# EAGLE design FY - OPTO_BOARD_4_IOX (EAGLE 6.1)

## Sheet 1 of 2
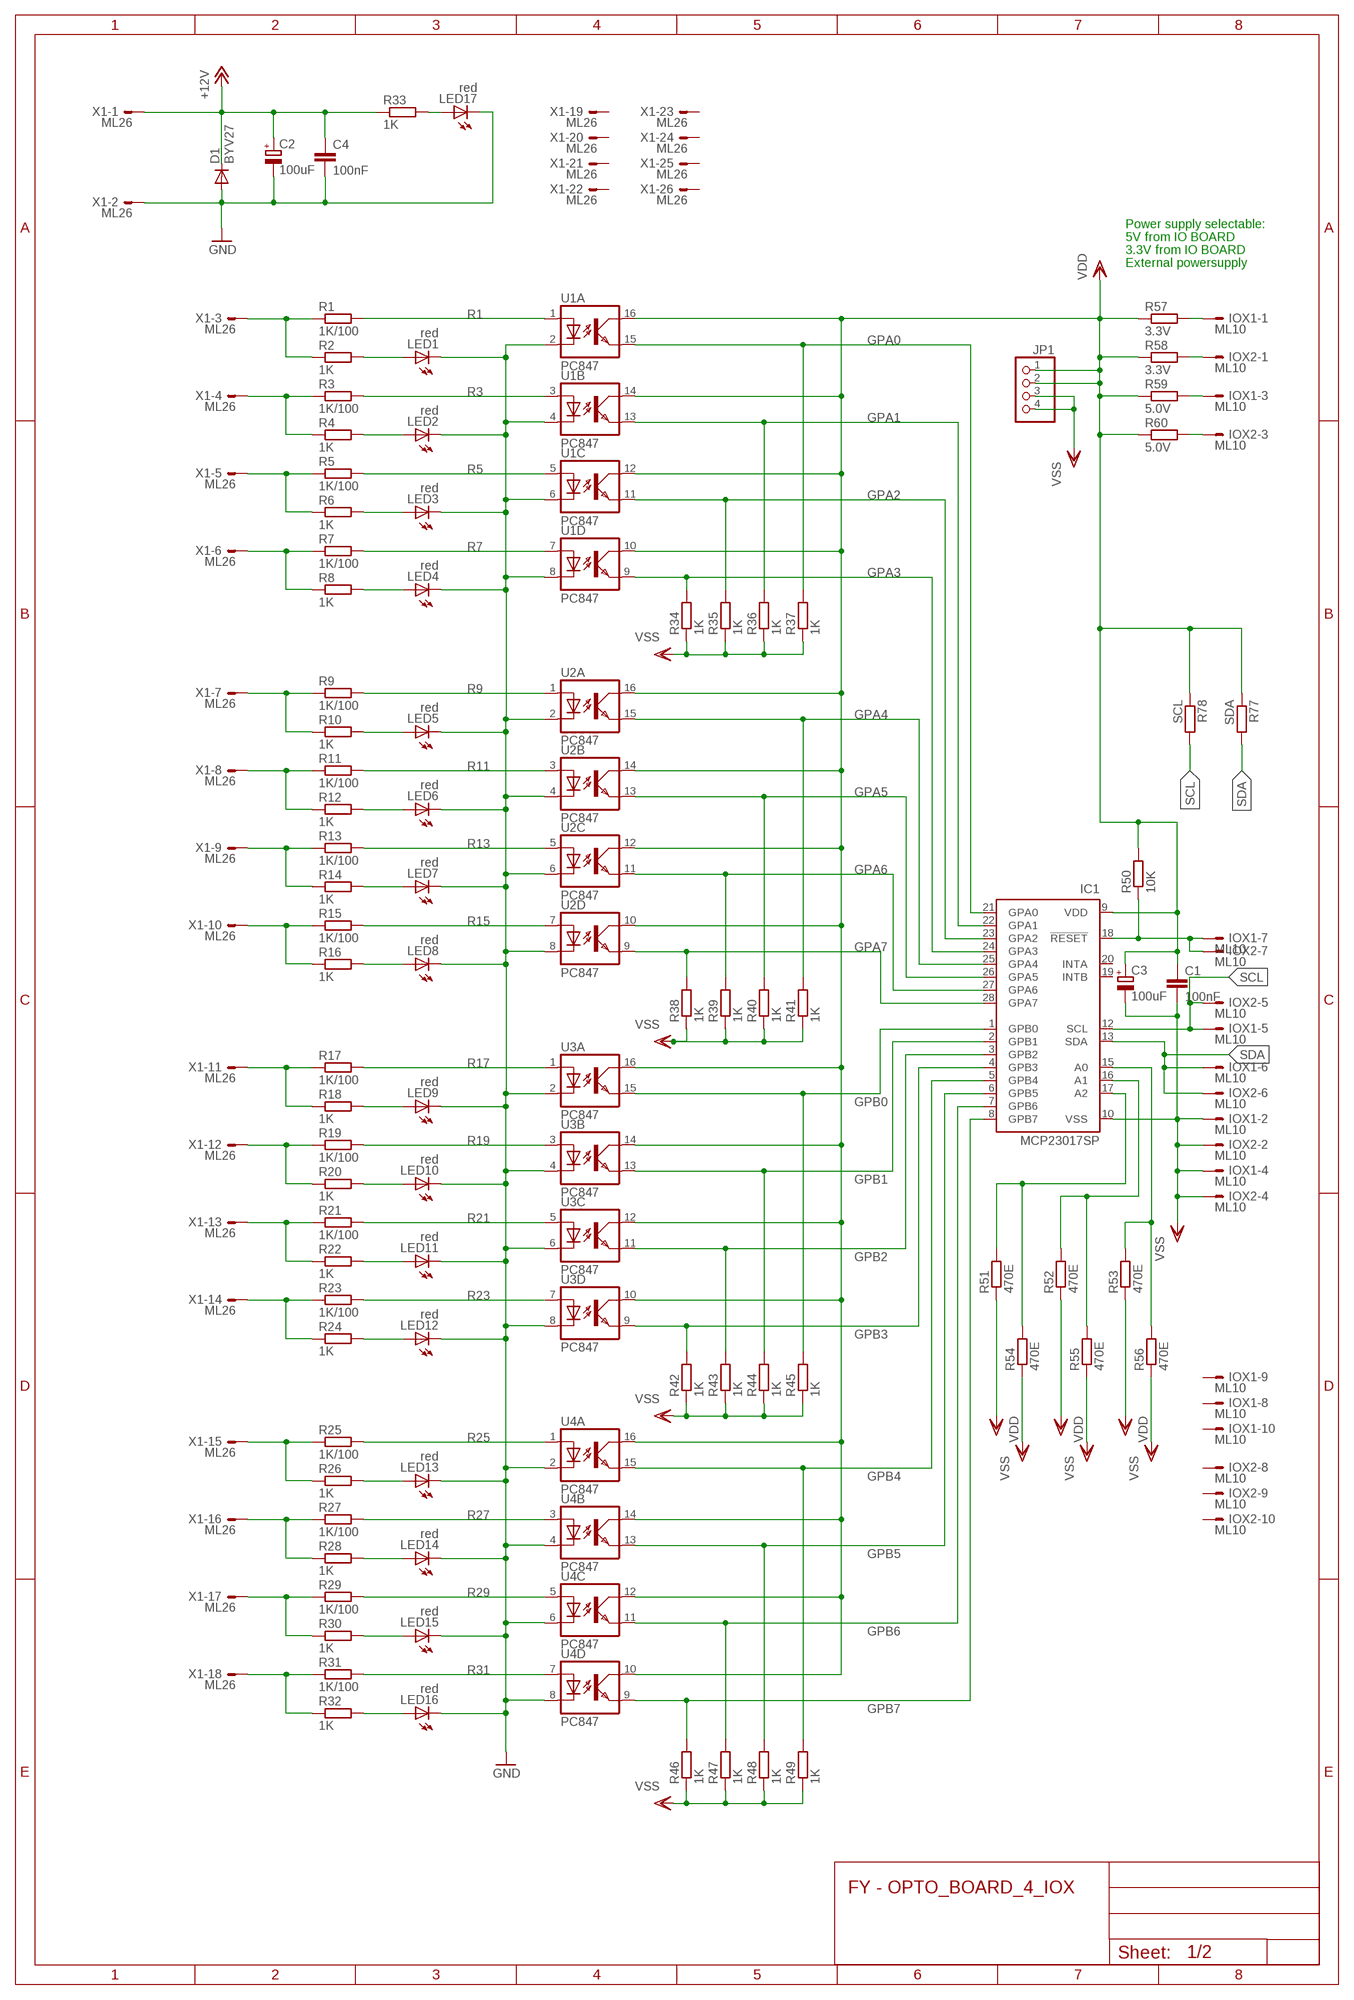
[diagram p0: schematic, sheet 1]

### Parts
C1  100nF  C-EU050-025X075  [C050-025X075]
C2  100uF  CPOL-EUE5-8.5  [E5-8,5]
C3  100uF  CPOL-EUE5-8.5  [E5-8,5]
C4  100nF  C-EU050-025X075  [C050-025X075]
D1  BYV27  [SOD57-10]
IC1  MCP23017SP  [DIL28-3]
IOX1  ML10  ML10E  [ML10]
IOX2  ML10  ML10E  [ML10]
JP1  PINHD-1X4  [1X04]
LED1  red  LED3MM  [LED3MM]
LED2  red  LED3MM  [LED3MM]
LED3  red  LED3MM  [LED3MM]
LED4  red  LED3MM  [LED3MM]
LED5  red  LED3MM  [LED3MM]
LED6  red  LED3MM  [LED3MM]
LED7  red  LED3MM  [LED3MM]
LED8  red  LED3MM  [LED3MM]
LED9  red  LED3MM  [LED3MM]
LED10  red  LED3MM  [LED3MM]
LED11  red  LED3MM  [LED3MM]
LED12  red  LED3MM  [LED3MM]
LED13  red  LED3MM  [LED3MM]
LED14  red  LED3MM  [LED3MM]
LED15  red  LED3MM  [LED3MM]
LED16  red  LED3MM  [LED3MM]
LED17  red  LED3MM  [LED3MM]
R1  1K/100  R-EU_0207/10  [0207/10]
R2  1K  R-EU_0207/10  [0207/10]
R3  1K/100  R-EU_0207/10  [0207/10]
R4  1K  R-EU_0207/10  [0207/10]
R5  1K/100  R-EU_0207/10  [0207/10]
R6  1K  R-EU_0207/10  [0207/10]
R7  1K/100  R-EU_0207/10  [0207/10]
R8  1K  R-EU_0207/10  [0207/10]
R9  1K/100  R-EU_0207/10  [0207/10]
R10  1K  R-EU_0207/10  [0207/10]
R11  1K/100  R-EU_0207/10  [0207/10]
R12  1K  R-EU_0207/10  [0207/10]
R13  1K/100  R-EU_0207/10  [0207/10]
R14  1K  R-EU_0207/10  [0207/10]
R15  1K/100  R-EU_0207/10  [0207/10]
R16  1K  R-EU_0207/10  [0207/10]
R17  1K/100  R-EU_0207/10  [0207/10]
R18  1K  R-EU_0207/10  [0207/10]
R19  1K/100  R-EU_0207/10  [0207/10]
R20  1K  R-EU_0207/10  [0207/10]
R21  1K/100  R-EU_0207/10  [0207/10]
R22  1K  R-EU_0207/10  [0207/10]
R23  1K/100  R-EU_0207/10  [0207/10]
R24  1K  R-EU_0207/10  [0207/10]
R25  1K/100  R-EU_0207/10  [0207/10]
R26  1K  R-EU_0207/10  [0207/10]
R27  1K/100  R-EU_0207/10  [0207/10]
R28  1K  R-EU_0207/10  [0207/10]
R29  1K/100  R-EU_0207/10  [0207/10]
R30  1K  R-EU_0207/10  [0207/10]
R31  1K/100  R-EU_0207/10  [0207/10]
R32  1K  R-EU_0207/10  [0207/10]
R33  1K  R-EU_0207/10  [0207/10]
R34  1K  R-EU_0207/10  [0207/10]
R35  1K  R-EU_0207/10  [0207/10]
R36  1K  R-EU_0207/10  [0207/10]
R37  1K  R-EU_0207/10  [0207/10]
R38  1K  R-EU_0207/10  [0207/10]
R39  1K  R-EU_0207/10  [0207/10]
R40  1K  R-EU_0207/10  [0207/10]
R41  1K  R-EU_0207/10  [0207/10]
R42  1K  R-EU_0207/10  [0207/10]
R43  1K  R-EU_0207/10  [0207/10]
R44  1K  R-EU_0207/10  [0207/10]
R45  1K  R-EU_0207/10  [0207/10]
R46  1K  R-EU_0207/10  [0207/10]
R47  1K  R-EU_0207/10  [0207/10]
R48  1K  R-EU_0207/10  [0207/10]
R49  1K  R-EU_0207/10  [0207/10]
R50  10K  R-EU_0207/10  [0207/10]
R51  470E  R-EU_0207/10  [0207/10]
R52  470E  R-EU_0207/10  [0207/10]
R53  470E  R-EU_0207/10  [0207/10]
R54  470E  R-EU_0207/10  [0207/10]
R55  470E  R-EU_0207/10  [0207/10]
R56  470E  R-EU_0207/10  [0207/10]
R57  3.3V  R-EU_0204/2V  [0204V]
R58  3.3V  R-EU_0204/2V  [0204V]
R59  5.0V  R-EU_0204/2V  [0204V]
R60  5.0V  R-EU_0204/2V  [0204V]
R77  SDA  R-EU_0207/10  [0207/10]
R78  SCL  R-EU_0207/10  [0207/10]
U1  PC847  [DIL16]
U2  PC847  [DIL16]
U3  PC847  [DIL16]
U4  PC847  [DIL16]
X1  ML26  ML26E  [ML26]

### Nets
+12V [Power]: C2.+ C4.1 D1.C R33.1 X1.1 ; also sheet 2
GND [Power]: C2.- C4.2 D1.A LED1.K(C) LED2.K(C) LED3.K(C) LED4.K(C) LED5.K(C) LED6.K(C) LED7.K(C) LED8.K(C) LED9.K(C) LED10.K(C) LED11.K(C) LED12.K(C) LED13.K(C) LED14.K(C) LED15.K(C) LED16.K(C) LED17.K(C) U1.2(A:C) U1.4(B:C) U1.6(C:C) U1.8(D:C) U2.2(A:C) U2.4(B:C) U2.6(C:C) U2.8(D:C) U3.2(A:C) U3.4(B:C) U3.6(C:C) U3.8(D:C) U4.2(A:C) U4.4(B:C) U4.6(C:C) U4.8(D:C) X1.2
GPA0: IC1.21(GPA0) R37.2 U1.15(A:EMIT) ; also sheet 2
GPA1: IC1.22(GPA1) R36.2 U1.13(B:EMIT) ; also sheet 2
GPA2: IC1.23(GPA2) R35.2 U1.11(C:EMIT) ; also sheet 2
GPA3: IC1.24(GPA3) R34.2 U1.9(D:EMIT) ; also sheet 2
GPA4: IC1.25(GPA4) R41.2 U2.15(A:EMIT) ; also sheet 2
GPA5: IC1.26(GPA5) R40.2 U2.13(B:EMIT) ; also sheet 2
GPA6: IC1.27(GPA6) R39.2 U2.11(C:EMIT) ; also sheet 2
GPA7: IC1.28(GPA7) R38.2 U2.9(D:EMIT) ; also sheet 2
GPB0: IC1.1(GPB0) R45.2 U3.15(A:EMIT) ; also sheet 2
GPB1: IC1.2(GPB1) R44.2 U3.13(B:EMIT) ; also sheet 2
GPB2: IC1.3(GPB2) R43.2 U3.11(C:EMIT) ; also sheet 2
GPB3: IC1.4(GPB3) R42.2 U3.9(D:EMIT) ; also sheet 2
GPB4: IC1.5(GPB4) R49.2 U4.15(A:EMIT) ; also sheet 2
GPB5: IC1.6(GPB5) R48.2 U4.13(B:EMIT) ; also sheet 2
GPB6: IC1.7(GPB6) R47.2 U4.11(C:EMIT) ; also sheet 2
GPB7: IC1.8(GPB7) R46.2 U4.9(D:EMIT) ; also sheet 2
N$3: LED1.A R2.2
N$5: LED2.A R4.2
N$6: LED3.A R6.2
N$7: LED4.A R8.2
N$16: LED5.A R10.2
N$20: LED6.A R12.2
N$23: LED7.A R14.2
N$26: LED8.A R16.2
N$30: LED9.A R18.2
N$33: LED10.A R20.2
N$36: LED11.A R22.2
N$39: LED12.A R24.2
N$41: LED13.A R26.2
N$44: LED14.A R28.2
N$47: LED15.A R30.2
N$50: LED16.A R32.2
N$52: LED17.A R33.2
N$59 [Power]: IOX1.1 R57.2
N$60 [Power]: IOX2.1 R58.2
N$61 [Power]: IOX1.3 R59.2
N$62: IC1.18(!RESET) IOX1.7 IOX2.7 R50.1
N$66: IC1.17(A2) R51.2 R54.2
N$67: IC1.16(A1) R52.2 R55.2
N$68: IC1.15(A0) R53.2 R56.2
N$71 [Power]: IOX2.3 R60.2
R1: R1.2 U1.1(A:A) ; also sheet 2
R3: R3.2 U1.3(B:A) ; also sheet 2
R5: R5.2 U1.5(C:A) ; also sheet 2
R7: R7.2 U1.7(D:A) ; also sheet 2
R9: R9.2 U2.1(A:A) ; also sheet 2
R11: R11.2 U2.3(B:A) ; also sheet 2
R13: R13.2 U2.5(C:A) ; also sheet 2
R15: R15.2 U2.7(D:A) ; also sheet 2
R17: R17.2 U3.1(A:A) ; also sheet 2
R19: R19.2 U3.3(B:A) ; also sheet 2
R21: R21.2 U3.5(C:A) ; also sheet 2
R23: R23.2 U3.7(D:A) ; also sheet 2
R25: R25.2 U4.1(A:A) ; also sheet 2
R27: R27.2 U4.3(B:A) ; also sheet 2
R29: R29.2 U4.5(C:A) ; also sheet 2
R31: R31.2 U4.7(D:A) ; also sheet 2
SCL: IC1.12(SCL) IOX1.5 IOX2.5 R78.2
SDA: IC1.13(SDA) IOX1.6 IOX2.6 R77.2
VDD [Power]: C1.1 C3.+ IC1.9(VDD) JP1.1 JP1.2 R50.2 R51.1 R52.1 R53.1 R57.1 R58.1 R59.1 R60.1 R77.1 R78.1 U1.10(D:COL) U1.12(C:COL) U1.14(B:COL) U1.16(A:COL) U2.10(D:COL) U2.12(C:COL) U2.14(B:COL) U2.16(A:COL) U3.10(D:COL) U3.12(C:COL) U3.14(B:COL) U3.16(A:COL) U4.10(D:COL) U4.12(C:COL) U4.14(B:COL) U4.16(A:COL)
VSS [Power]: C1.2 C3.- IC1.10(VSS) IOX1.2 IOX1.4 IOX2.2 IOX2.4 JP1.3 JP1.4 R34.1 R35.1 R36.1 R37.1 R38.1 R39.1 R40.1 R41.1 R42.1 R43.1 R44.1 R45.1 R46.1 R47.1 R48.1 R49.1 R54.1 R55.1 R56.1 ; also sheet 2
X1-3: R1.1 R2.1 X1.3
X1-4: R3.1 R4.1 X1.4
X1-5: R5.1 R6.1 X1.5
X1-6: R7.1 R8.1 X1.6
X1-7: R9.1 R10.1 X1.7
X1-8: R11.1 R12.1 X1.8
X1-9: R13.1 R14.1 X1.9
X1-10: R15.1 R16.1 X1.10
X1-11: R17.1 R18.1 X1.11
X1-12: R19.1 R20.1 X1.12
X1-13: R21.1 R22.1 X1.13
X1-14: R23.1 R24.1 X1.14
X1-15: R25.1 R26.1 X1.15
X1-16: R27.1 R28.1 X1.16
X1-17: R29.1 R30.1 X1.17
X1-18: R31.1 R32.1 X1.18
Unconnected: IC1.19(INTB) IC1.20(INTA) IOX1.8 IOX1.9 IOX1.10 IOX2.8 IOX2.9 IOX2.10 X1.19 X1.20 X1.21 X1.22 X1.23 X1.24 X1.25 X1.26

### Notes on the sheet
- Power supply selectable:
- 5V from IO BOARD
- 3.3V from IO BOARD
- External powersupply

## Sheet 2 of 2
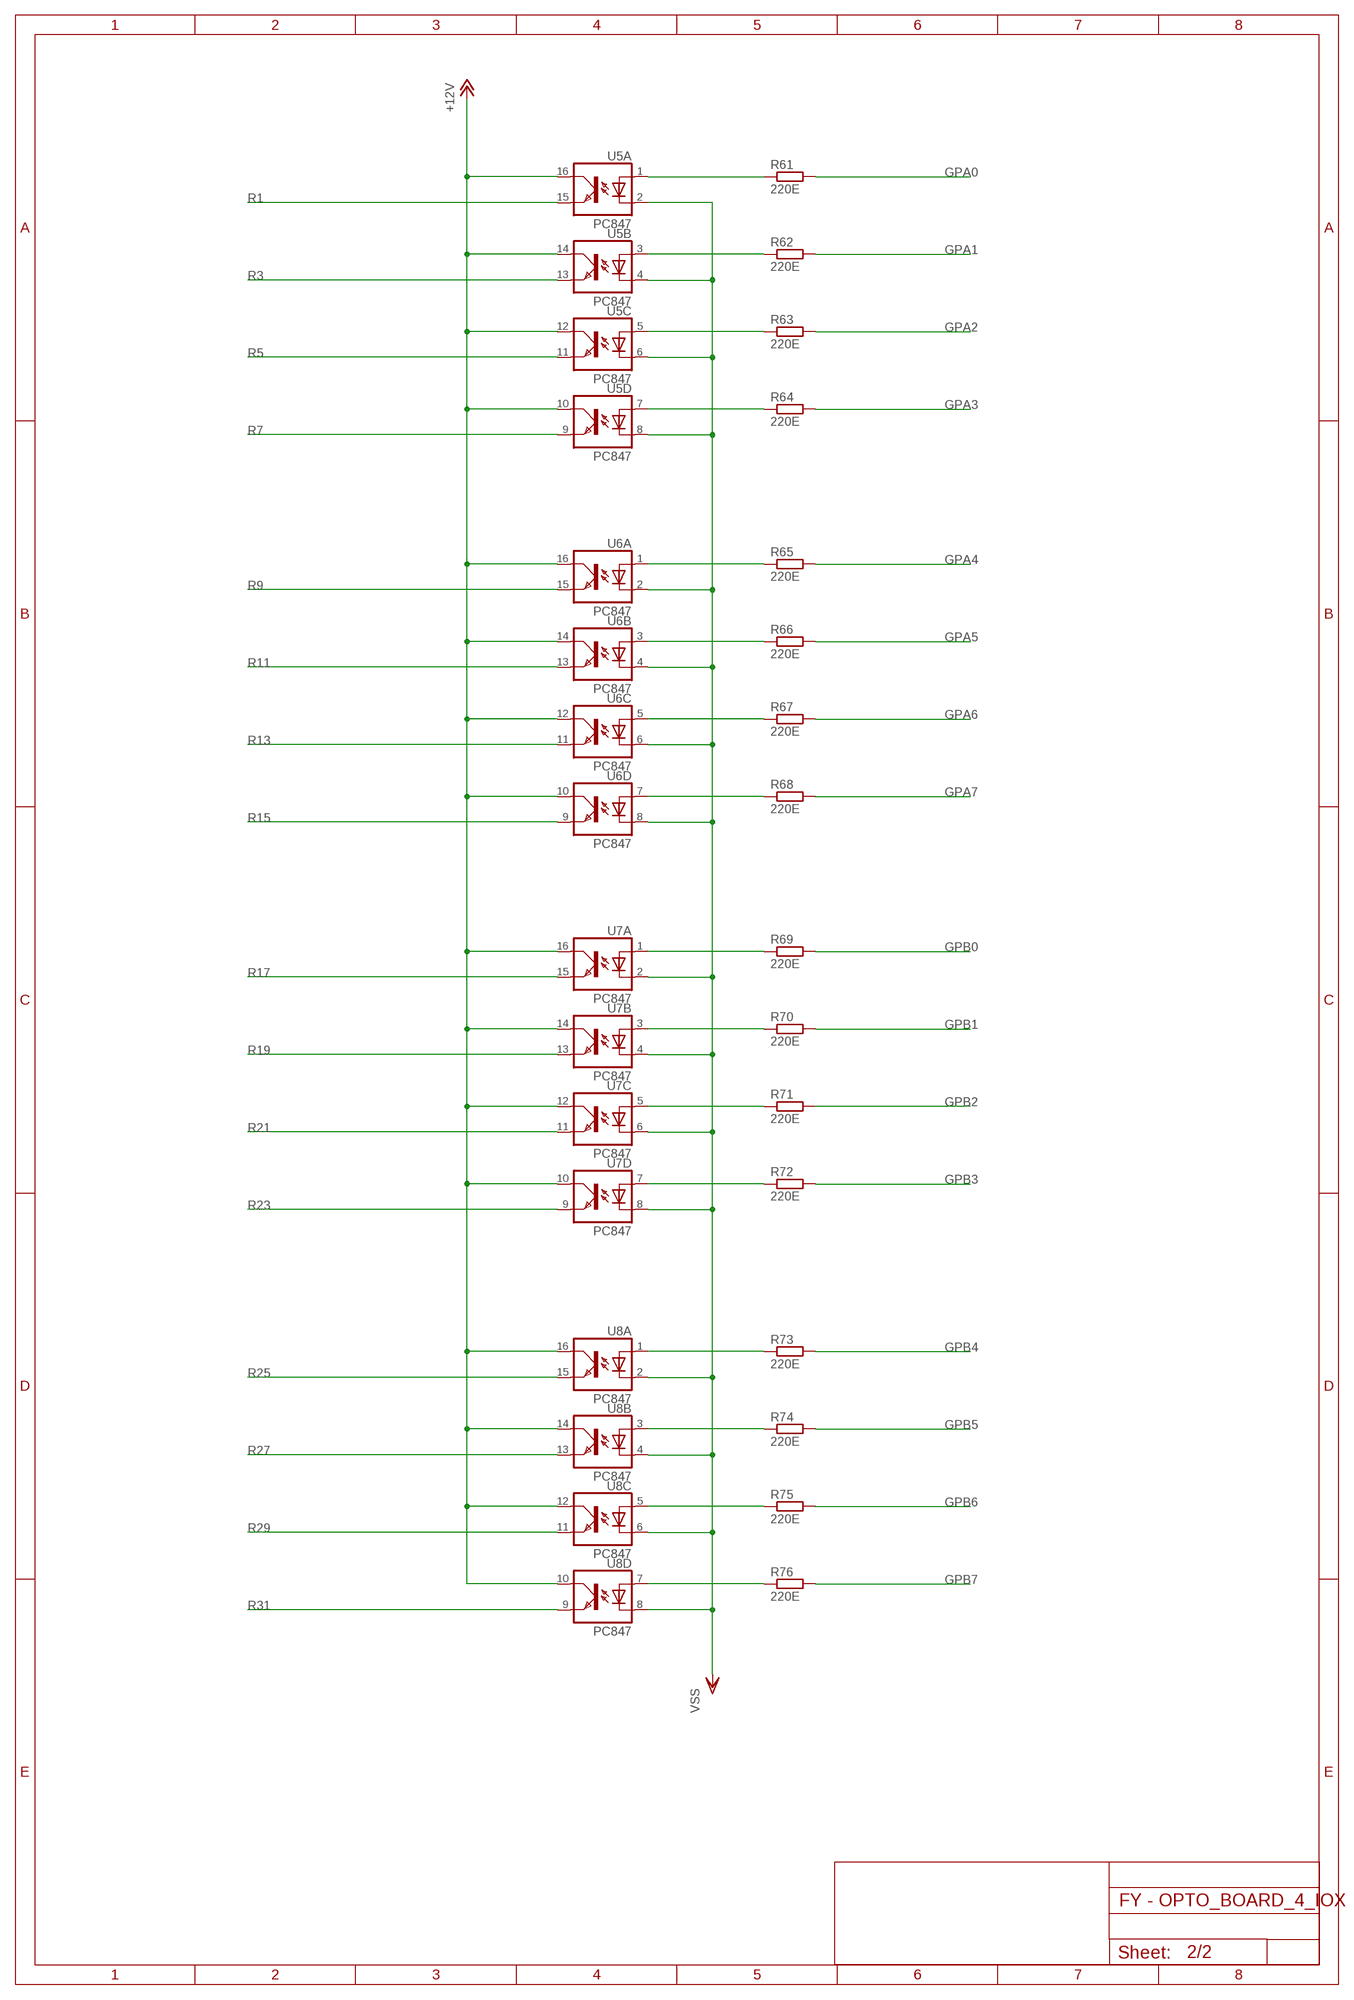
[diagram p1: schematic, sheet 2]

### Parts
R61  220E  R-EU_0207/10  [0207/10]
R62  220E  R-EU_0207/10  [0207/10]
R63  220E  R-EU_0207/10  [0207/10]
R64  220E  R-EU_0207/10  [0207/10]
R65  220E  R-EU_0207/10  [0207/10]
R66  220E  R-EU_0207/10  [0207/10]
R67  220E  R-EU_0207/10  [0207/10]
R68  220E  R-EU_0207/10  [0207/10]
R69  220E  R-EU_0207/10  [0207/10]
R70  220E  R-EU_0207/10  [0207/10]
R71  220E  R-EU_0207/10  [0207/10]
R72  220E  R-EU_0207/10  [0207/10]
R73  220E  R-EU_0207/10  [0207/10]
R74  220E  R-EU_0207/10  [0207/10]
R75  220E  R-EU_0207/10  [0207/10]
R76  220E  R-EU_0207/10  [0207/10]
U5  PC847  [DIL16]
U6  PC847  [DIL16]
U7  PC847  [DIL16]
U8  PC847  [DIL16]

### Nets
+12V [Power]: U5.10(D:COL) U5.12(C:COL) U5.14(B:COL) U5.16(A:COL) U6.10(D:COL) U6.12(C:COL) U6.14(B:COL) U6.16(A:COL) U7.10(D:COL) U7.12(C:COL) U7.14(B:COL) U7.16(A:COL) U8.10(D:COL) U8.12(C:COL) U8.14(B:COL) U8.16(A:COL) ; also sheet 1
GPA0: R61.2 ; also sheet 1
GPA1: R62.2 ; also sheet 1
GPA2: R63.2 ; also sheet 1
GPA3: R64.2 ; also sheet 1
GPA4: R65.2 ; also sheet 1
GPA5: R66.2 ; also sheet 1
GPA6: R67.2 ; also sheet 1
GPA7: R68.2 ; also sheet 1
GPB0: R69.2 ; also sheet 1
GPB1: R70.2 ; also sheet 1
GPB2: R71.2 ; also sheet 1
GPB3: R72.2 ; also sheet 1
GPB4: R73.2 ; also sheet 1
GPB5: R74.2 ; also sheet 1
GPB6: R75.2 ; also sheet 1
GPB7: R76.2 ; also sheet 1
N$1: R61.1 U5.1(A:A)
N$11: R62.1 U5.3(B:A)
N$12: R63.1 U5.5(C:A)
N$13: R64.1 U5.7(D:A)
N$14: R65.1 U6.1(A:A)
N$15: R66.1 U6.3(B:A)
N$17: R67.1 U6.5(C:A)
N$18: R68.1 U6.7(D:A)
N$19: R69.1 U7.1(A:A)
N$22: R70.1 U7.3(B:A)
N$25: R71.1 U7.5(C:A)
N$29: R72.1 U7.7(D:A)
N$31: R73.1 U8.1(A:A)
N$32: R74.1 U8.3(B:A)
N$35: R75.1 U8.5(C:A)
N$38: R76.1 U8.7(D:A)
R1: U5.15(A:EMIT) ; also sheet 1
R3: U5.13(B:EMIT) ; also sheet 1
R5: U5.11(C:EMIT) ; also sheet 1
R7: U5.9(D:EMIT) ; also sheet 1
R9: U6.15(A:EMIT) ; also sheet 1
R11: U6.13(B:EMIT) ; also sheet 1
R13: U6.11(C:EMIT) ; also sheet 1
R15: U6.9(D:EMIT) ; also sheet 1
R17: U7.15(A:EMIT) ; also sheet 1
R19: U7.13(B:EMIT) ; also sheet 1
R21: U7.11(C:EMIT) ; also sheet 1
R23: U7.9(D:EMIT) ; also sheet 1
R25: U8.15(A:EMIT) ; also sheet 1
R27: U8.13(B:EMIT) ; also sheet 1
R29: U8.11(C:EMIT) ; also sheet 1
R31: U8.9(D:EMIT) ; also sheet 1
VSS [Power]: U5.2(A:C) U5.4(B:C) U5.6(C:C) U5.8(D:C) U6.2(A:C) U6.4(B:C) U6.6(C:C) U6.8(D:C) U7.2(A:C) U7.4(B:C) U7.6(C:C) U7.8(D:C) U8.2(A:C) U8.4(B:C) U8.6(C:C) U8.8(D:C) ; also sheet 1

## Library data of the parts
C1 C4 = rcl:C-EU: CAPACITOR, European symbol
C2 C3 = rcl:CPOL-EU: POLARIZED CAPACITOR, European symbol
D1 = diode:BYV27: DIODE ultra fast
IC1 = microchip:MCP23017: http://ww1.microchip.com/downloads/en/DeviceDoc/21952a.pdf Source: http://ww1.microchip.com/downloads/en/DeviceDoc/21952a.pdf; MF: MICROCHIP; MPN: MCP23017-E/SP; OC_FARNELL: 1332088; OC_NEWARK: 31K2959
IOX1 IOX2 = con-harting-ml:ML10?E: HARTING; OC_FARNELL: unknown; OC_NEWARK: unknown
JP1 = pinhead:PINHD-1X4: PIN HEADER
LED1-LED17 = led:LED: LED OSRAM: - CHIPLED LG R971, LG N971, LY N971, LG Q971, LY Q971, LO R971, LY R971 LH N974, LH R974 LS Q976, LO Q976, LY Q976 LO Q996 - Hyper CHIPLED LW Q18S LB Q993, LB Q99A, LB R99A - SideLED LS A670, LO A670, LY A670, LG A670, LP A670 LB A673, LV A673, LT A673, LW A673 LH A674 LY A675 LS A676, LA A676, LO A676, LY A676, LW A676 LS A679, LY A679, LG A679 - Hyper Micro SIDELED® LS Y876, LA Y876, LO Y876, LY Y876 LT Y87S - SmartLED LW L88C, LW L88S LB L89C, LB L89S, LG L890 LS L89K, LO L89K, LY L89K LS L896, LA L896, LO L896, LY L896 - TOPLED LS T670, LO T670, LY T670, LG T670, LP T670 LSG T670, LSP T670, LSY T670, LOP T670, LYG T670 LG T671, LOG T671, LSG T671 LB T673, LV T673, LT T673, LW T673 LH T674 LS T676, LA T676, LO T676, LY T676, LB T676, LH T676, LSB T676, LW T676 LB T67C, LV T67C, LT T67C, LS T67K, LO T67K, LY T67K, LW E67C LS E67B, LA E67B, LO E67B, LY E67B, LB E67C, LV E67C, LT E67C LW T67C LS T679, LY T679, LG T679 LS T770, LO T770, LY T770, LG T770, LP T770 LB T773, LV T773, LT T773, LW T773 LH T774 LS E675, LA E675, LY E675, LS T675 LS T776, LA T776, LO T776, LY T776, LB T776 LHGB T686 LT T68C, LB T68C - Hyper Mini TOPLED® LB M676 - Mini TOPLED Santana® LG M470 LS M47K, LO M47K, LY M47K Source: http://www.osram.convergy.de LUXEON: - LUMILED® LXK2-PW12-R00, LXK2-PW12-S00, LXK2-PW14-U00, LXK2-PW14-V00 LXK2-PM12-R00, LXK2-PM12-S00, LXK2-PM14-U00 LXK2-PE12-Q00, LXK2-PE12-R00, LXK2-PE12-S00, LXK2-PE14-T00, LXK2-PE14-U00 LXK2-PB12-K00, LXK2-PB12-L00, LXK2-PB12-M00, LXK2-PB14-N00, LXK2-PB14-P00, LXK2-PB14-Q00 LXK2-PR12-L00, LXK2-PR12-M00, LXK2-PR14-Q00, LXK2-PR14-R00 LXK2-PD12-Q00, LXK2-PD12-R00, LXK2-PD12-S00 LXK2-PH12-R00, LXK2-PH12-S00 LXK2-PL12-P00, LXK2-PL12-Q00, LXK2-PL12-R00 Source: www.luxeon.com KINGBRIGHT: KA-3528ASYC Source: www.kingbright.com
R1-R78 = rcl:R-EU_: RESISTOR, European symbol
U1-U8 = optocoupler:PC847: SHARP OPTO COUPLER; OC_FARNELL: 9707735; OC_NEWARK: unknown
X1 = con-harting-ml:ML26?E: HARTING; OC_FARNELL: unknown; OC_NEWARK: unknown

## Net classes
0 default: width 0.305 mm, clearance 0.305 mm
1 Power: width 0.61 mm, clearance 0.305 mm

## Board
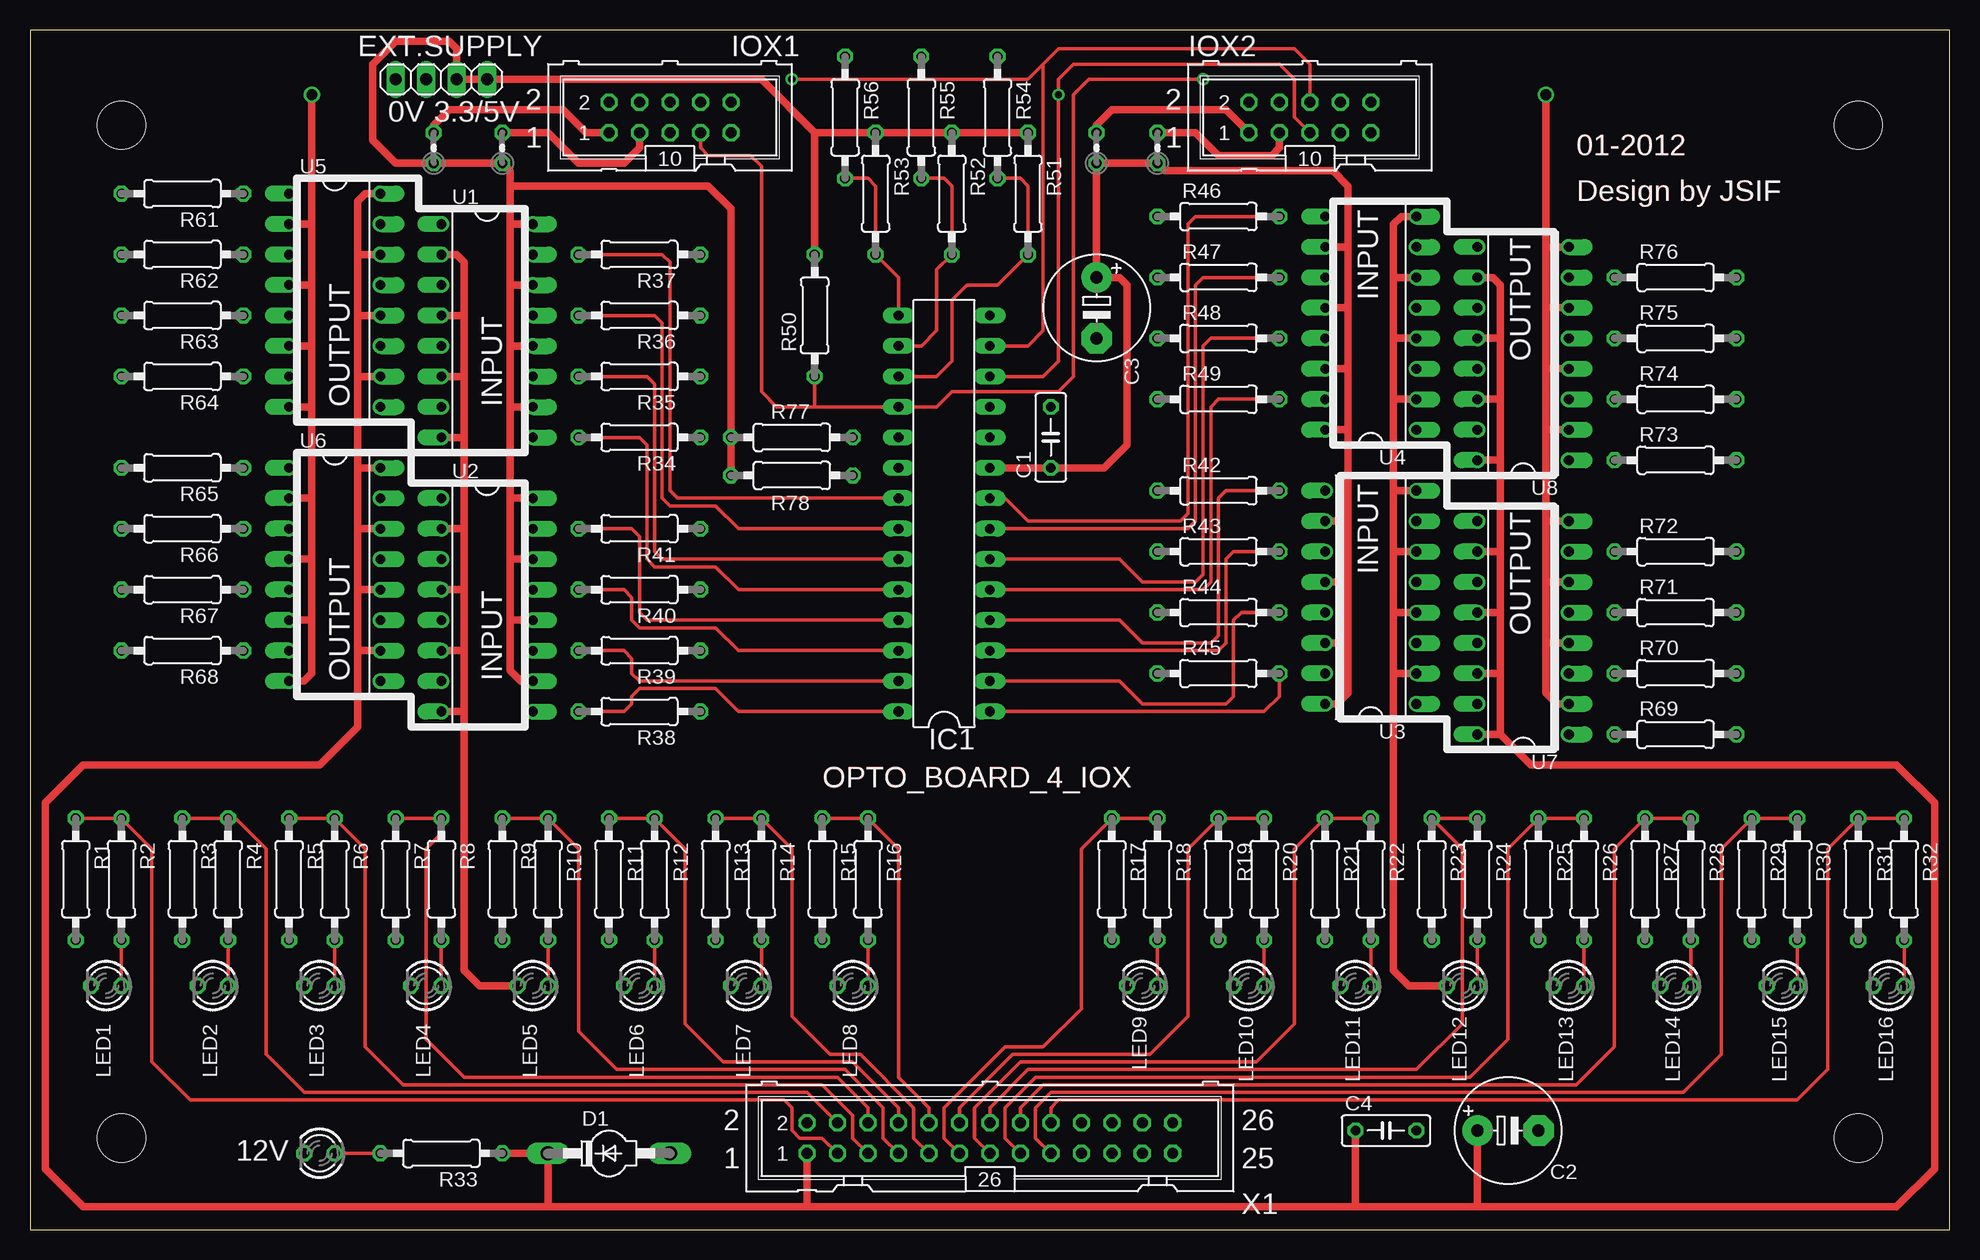
[diagram p2: board, top side]
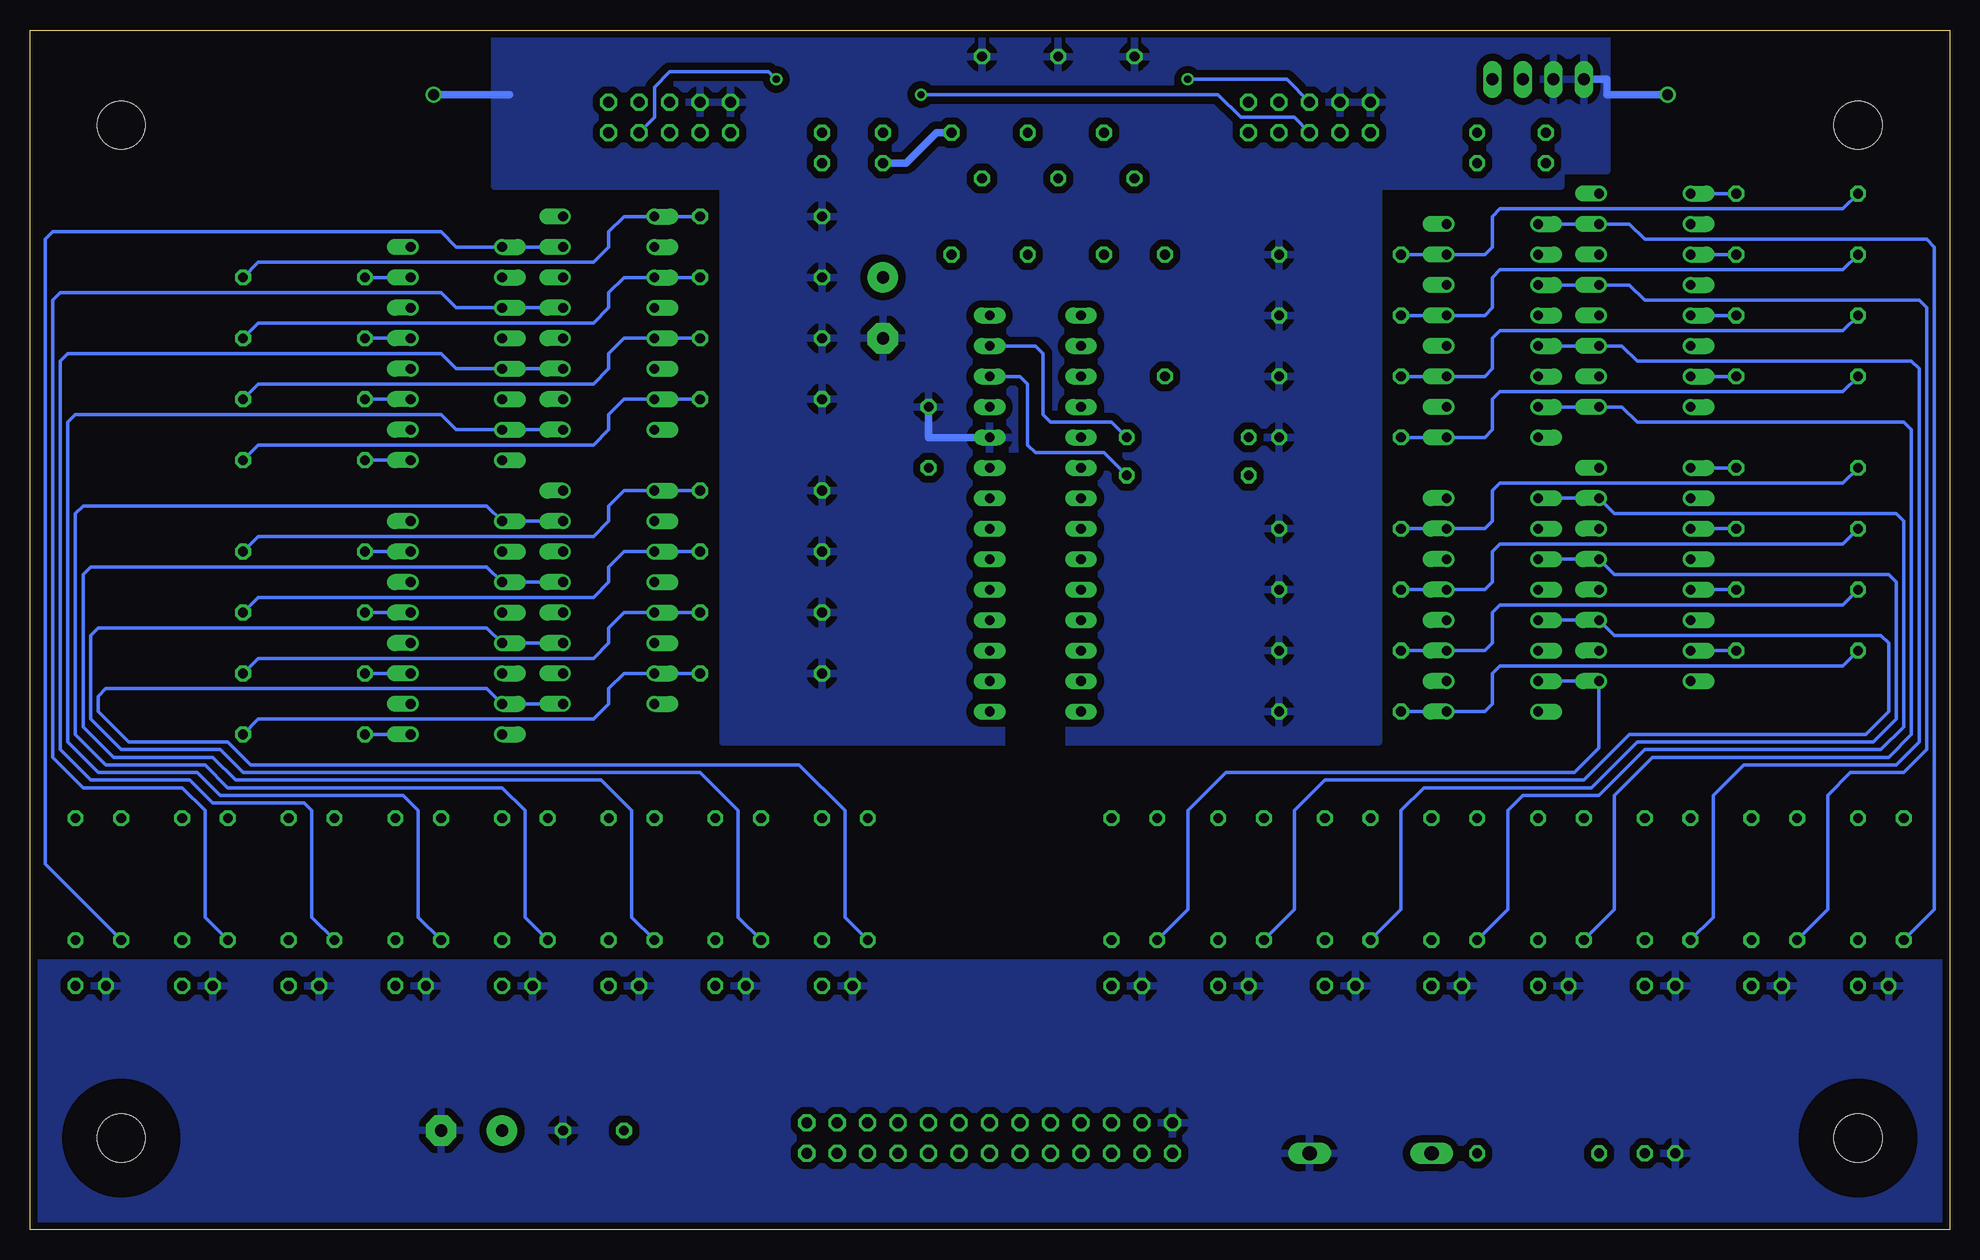
[diagram p3: board, bottom side, seen from below]

Size 160 x 100 mm. Coordinates in mm from the lower left corner, seen from the top.
Outline: 0,0 160,0 160,100 0,100 0,0
Copper layers (1*16): Top 0.035mm / dielectric 1.5mm / Bottom 0.035mm
Design rules: minimum track width 12mil, minimum drill 12mil, track to track 8mil, track to pad 8mil, pad to pad 8mil, via to via 8mil, smd to smd 8mil, copper to edge 24mil, drill to drill 8mil, minimum pad ring 10mil, minimum via ring 8mil, stop-mask expansion 4mil, vias tented up to drill 0mil, thermal gap 24mil
Holes 4 mm at 7.62,7.62 7.62,92.08 152.4,92.08 152.4,7.62
bRestrict: area 3.6,3.6 to 11.6,11.6; area 148.4,3.6 to 156.4,11.6; area 148.4,88.1 to 156.4,96.1; area 3.6,88.1 to 11.6,96.1; area 74.3,40.6 to 78.1,64.1

### Footprints (pad centres in the part's own frame; a part is rotated, then mirrored left to right if it is on the bottom)
C050-025X075 = drill 0.813 octagon: 1 -2.54,0; 2 2.54,0
E5-8,5 = drill 1.016 pad 2.54: + -2.54,0 | drill 1.016 pad 2.54 octagon: - 2.54,0
SOD57-10 = drill 1.194 long: A 5.08,0; C -5.08,0
DIL28-3 = drill 0.813 long: 1 -16.51,-3.81; 2 -13.97,-3.81; 3 -11.43,-3.81; 4 -8.89,-3.81; 5 -6.35,-3.81; 6 -3.81,-3.81; 7 -1.27,-3.81; 8 1.27,-3.81; 9 3.81,-3.81; 10 6.35,-3.81; 11 8.89,-3.81; 12 11.43,-3.81; 13 13.97,-3.81; 14 16.51,-3.81; 15 16.51,3.81; 16 13.97,3.81; 17 11.43,3.81; 18 8.89,3.81; 19 6.35,3.81; 20 3.81,3.81; 21 1.27,3.81; 22 -1.27,3.81; 23 -3.81,3.81; 24 -6.35,3.81; 25 -8.89,3.81; 26 -11.43,3.81; 27 -13.97,3.81; 28 -16.51,3.81
ML10 = drill 0.914 octagon: 1 -5.08,-1.27; 2 -5.08,1.27; 3 -2.54,-1.27; 4 -2.54,1.27; 5 0,-1.27; 6 0,1.27; 7 2.54,-1.27; 8 2.54,1.27; 9 5.08,-1.27; 10 5.08,1.27
1X04 = drill 1.016 long: 1 -3.81,0; 2 -1.27,0; 3 1.27,0; 4 3.81,0
LED3MM = drill 0.813 octagon: A -1.27,0; K 1.27,0
0207/10 = drill 0.813 octagon: 1 -5.08,0; 2 5.08,0
0204V = drill 0.813 octagon: 1 -1.27,0; 2 1.27,0
DIL16 = drill 0.813 offset: 1 -8.89,-3.81; 2 -6.35,-3.81; 3 -3.81,-3.81; 4 -1.27,-3.81; 5 1.27,-3.81; 6 3.81,-3.81; 7 6.35,-3.81; 8 8.89,-3.81; 9 8.89,3.81; 10 6.35,3.81; 11 3.81,3.81; 12 1.27,3.81; 13 -1.27,3.81; 14 -3.81,3.81; 15 -6.35,3.81; 16 -8.89,3.81
ML26 = drill 0.914 octagon: 1 -15.24,-1.27; 2 -15.24,1.27; 3 -12.7,-1.27; 4 -12.7,1.27; 5 -10.16,-1.27; 6 -10.16,1.27; 7 -7.62,-1.27; 8 -7.62,1.27; 9 -5.08,-1.27; 10 -5.08,1.27; 11 -2.54,-1.27; 12 -2.54,1.27; 13 0,-1.27; 14 0,1.27; 15 2.54,-1.27; 16 2.54,1.27; 17 5.08,-1.27; 18 5.08,1.27; 19 7.62,-1.27; 20 7.62,1.27; 21 10.16,-1.27; 22 10.16,1.27; 23 12.7,-1.27; 24 12.7,1.27; 25 15.24,-1.27; 26 15.24,1.27

### Placement (x,y rotation side)
C1  85.09,66.04 90 top
C2  123.19,8.26 0 top
C3  88.9,76.83 270 top
C4  113.03,8.26 0 top
D1  48.26,6.35 0 top
IC1  76.2,59.69 90 top
IOX1  53.34,92.71 0 top
IOX2  106.68,92.71 0 top
JP1  34.29,95.89 180 top
LED1  6.35,20.32 180 top
LED2  15.24,20.32 180 top
LED3  24.13,20.32 180 top
LED4  33.02,20.32 180 top
LED5  41.91,20.32 180 top
LED6  50.8,20.32 180 top
LED7  59.69,20.32 180 top
LED8  68.58,20.32 180 top
LED9  92.71,20.32 180 top
LED10  101.6,20.32 180 top
LED11  110.49,20.32 180 top
LED12  119.38,20.32 180 top
LED13  128.27,20.32 180 top
LED14  137.16,20.32 180 top
LED15  146.05,20.32 180 top
LED16  154.94,20.32 180 top
LED17  24.13,6.35 180 top
R1  3.81,29.21 270 top
R2  7.62,29.21 270 top
R3  12.7,29.21 270 top
R4  16.51,29.21 270 top
R5  21.59,29.21 270 top
R6  25.4,29.21 270 top
R7  30.48,29.21 270 top
R8  34.29,29.21 270 top
R9  39.37,29.21 270 top
R10  43.18,29.21 270 top
R11  48.26,29.21 270 top
R12  52.07,29.21 270 top
R13  57.15,29.21 270 top
R14  60.96,29.21 270 top
R15  66.04,29.21 270 top
R16  69.85,29.21 270 top
R17  90.17,29.21 270 top
R18  93.98,29.21 270 top
R19  99.06,29.21 270 top
R20  102.87,29.21 270 top
R21  107.95,29.21 270 top
R22  111.76,29.21 270 top
R23  116.84,29.21 270 top
R24  120.65,29.21 270 top
R25  125.73,29.21 270 top
R26  129.54,29.21 270 top
R27  134.62,29.21 270 top
R28  138.43,29.21 270 top
R29  143.51,29.21 270 top
R30  147.32,29.21 270 top
R31  152.4,29.21 270 top
R32  156.21,29.21 270 top
R33  34.29,6.35 180 top
R34  50.8,66.04 180 top
R35  50.8,71.12 180 top
R36  50.8,76.2 180 top
R37  50.8,81.28 180 top
R38  50.8,43.18 180 top
R39  50.8,48.26 180 top
R40  50.8,53.34 180 top
R41  50.8,58.42 180 top
R42  99.06,61.59 0 top
R43  99.06,56.52 0 top
R44  99.06,51.44 0 top
R45  99.06,46.35 0 top
R46  99.06,84.45 0 top
R47  99.06,79.38 0 top
R48  99.06,74.3 0 top
R49  99.06,69.22 0 top
R50  65.41,76.2 90 top
R51  83.19,86.36 270 top
R52  76.83,86.36 270 top
R53  70.48,86.36 270 top
R54  80.64,92.71 270 top
R55  74.3,92.71 270 top
R56  67.94,92.71 270 top
R57  33.66,90.17 90 top
R58  88.9,90.17 90 top
R59  39.37,90.17 90 top
R60  93.98,90.17 90 top
R61  12.7,86.36 180 top
R62  12.7,81.28 180 top
R63  12.7,76.2 180 top
R64  12.7,71.12 180 top
R65  12.7,63.5 180 top
R66  12.7,58.42 180 top
R67  12.7,53.34 180 top
R68  12.7,48.26 180 top
R69  137.16,41.27 0 top
R70  137.16,46.35 0 top
R71  137.16,51.44 0 top
R72  137.16,56.52 0 top
R73  137.16,64.14 0 top
R74  137.16,69.22 0 top
R75  137.16,74.3 0 top
R76  137.16,79.38 0 top
R77  63.5,66.04 0 top
R78  63.5,62.87 0 top
U1  38.1,74.93 270 top
U2  38.1,52.07 270 top
U3  111.76,52.7 90 top
U4  111.76,75.56 90 top
U5  25.4,77.47 270 top
U6  25.4,54.61 270 top
U7  124.46,50.16 90 top
U8  124.46,73.03 90 top
X1  80.01,7.62 0 top

### Tracks (layer width: path | path; a pad name or v marks a point on that pad's centre or on a via)
+12V
  Top 0.61: R33.1 D1.C 43.18,1.91 | 64.77,1.91 43.18,1.91 | 43.18,1.91 4.45,1.91 1.27,5.08 1.27,35.56 4.45,38.73 24.13,38.73 27.3,41.91 27.3,48.26 | 27.3,81.28 27.3,85.72 27.94,86.36 U5.16 | U5.14 27.3,81.28 | 27.3,81.28 27.3,76.2 | U5.12 27.3,76.2 | 27.3,76.2 27.3,71.12 | U5.10 27.3,71.12 | 27.3,71.12 27.3,63.5 | U6.16 27.3,63.5 | 27.3,63.5 27.3,58.42 | U6.14 27.3,58.42 | 27.3,58.42 27.3,53.34 | 27.3,53.34 U6.12 | U6.10 27.3,48.26 | 27.3,48.26 27.3,53.34 | 64.77,1.91 110.49,1.91 | 110.49,1.91 120.65,1.91 | 120.65,1.91 155.57,1.91 158.75,5.08 158.75,35.56 155.57,38.73 125.09,38.73 122.56,41.27 | U8.10 121.92,79.38 122.56,78.74 122.56,74.3 | U8.12 122.56,74.3 | 122.56,74.3 122.56,69.22 | U8.14 122.56,69.22 | 122.56,69.22 122.56,64.14 | U8.16 122.56,64.14 | 122.56,64.14 122.56,56.52 | U7.10 122.56,56.52 | 122.56,56.52 122.56,51.44 | U7.12 122.56,51.44 | 122.56,51.44 122.56,46.35 | U7.14 122.56,46.35 | 122.56,46.35 122.56,41.27 | 122.56,41.27 U7.16 | X1.1 64.77,1.91 | C4.1 110.49,1.91 | C2.+ 120.65,1.91
GND
  Top 0.61: U1.2 35.56,81.28 36.2,80.64 36.2,76.2 | U1.4 36.2,76.2 | 36.2,76.2 36.2,71.12 | U1.6 36.2,71.12 | 36.2,71.12 36.2,66.04 | U1.8 36.2,66.04 | 36.2,66.04 36.2,58.42 | U2.2 36.2,58.42 | 36.2,58.42 36.2,53.34 | U2.4 36.2,53.34 | 36.2,53.34 36.2,48.26 | U2.6 36.2,48.26 | 36.2,48.26 36.2,43.18 | U2.8 36.2,43.18 | 36.2,43.18 36.2,21.59 37.47,20.32 LED5.K | U4.8 114.3,84.45 113.67,83.82 113.67,79.38 | U4.6 113.67,79.38 | 113.67,79.38 113.67,74.3 | U4.4 113.67,74.3 | 113.67,74.3 113.67,69.22 | U4.2 113.67,69.22 | 113.67,69.22 113.67,61.59 | U3.8 113.67,61.59 | 113.67,61.59 113.67,56.52 | U3.6 113.67,56.52 | 113.67,56.52 113.67,51.44 | U3.4 113.67,51.44 | 113.67,51.44 113.67,46.35 | U3.2 113.67,46.35 | 113.67,46.35 113.67,21.59 114.94,20.32 LED12.K
  pour Bottom (isolate 0.61): 0.64,0.64 159.38,0.64 159.38,22.23 0.64,22.23
GPA0
  Top 0.305: IC1.21 53.98,60.96 53.34,61.59 53.34,80.64 52.7,81.28 R37.2
  Bottom 0.305: R61.2 8.89,85.09 37.47,85.09 38.1,84.45 38.1,81.92 38.73,81.28 U1.15 R37.2
GPA1
  Top 0.305: IC1.22 59.05,58.42 57.15,60.33 53.34,60.33 52.7,60.96 52.7,75.56 52.07,76.2 R36.2
  Bottom 0.305: R62.2 8.89,80.01 37.47,80.01 38.1,79.38 38.1,76.83 38.73,76.2 U1.13 R36.2
GPA2
  Top 0.305: IC1.23 52.7,55.88 52.07,56.52 52.07,70.48 51.44,71.12 R35.2
  Bottom 0.305: R63.2 8.89,74.93 37.47,74.93 38.1,74.3 38.1,71.75 38.73,71.12 U1.11 R35.2
GPA3
  Top 0.305: IC1.24 59.05,53.34 57.15,55.24 52.07,55.24 51.44,55.88 51.44,65.41 50.8,66.04 R34.2
  Bottom 0.305: R64.2 8.89,69.85 37.47,69.85 38.1,69.22 38.1,66.67 38.73,66.04 U1.9 R34.2
GPA4
  Top 0.305: IC1.25 51.44,50.8 50.8,51.44 50.8,57.78 50.16,58.42 R41.2
  Bottom 0.305: R65.2 8.89,62.23 37.47,62.23 38.1,61.59 38.1,59.05 38.73,58.42 U2.15 R41.2
GPA5
  Top 0.305: IC1.26 59.05,48.26 57.15,50.16 50.8,50.16 50.16,50.8 50.16,52.7 49.53,53.34 R40.2
  Bottom 0.305: R66.2 8.89,57.15 37.47,57.15 38.1,56.52 38.1,53.98 38.73,53.34 U2.13 R40.2
GPA6
  Top 0.305: IC1.27 50.8,45.72 50.16,46.35 50.16,47.62 49.53,48.26 R39.2
  Bottom 0.305: R67.2 8.89,52.07 37.47,52.07 38.1,51.44 38.1,48.9 38.73,48.26 U2.11 R39.2
GPA7
  Top 0.305: IC1.28 59.05,43.18 57.15,45.09 50.8,45.09 50.16,44.45 50.16,43.81 49.53,43.18 R38.2
  Bottom 0.305: R68.2 8.89,46.99 37.47,46.99 38.1,46.35 38.1,43.81 38.73,43.18 U2.9 R38.2
GPB0
  Top 0.305: IC1.1 102.87,43.18 104.14,44.45 R45.2
  Bottom 0.305: R69.2 140.97,42.55 113.03,42.55 111.76,43.81 111.76,45.09 110.49,46.35 U3.15 R45.2
GPB1
  Top 0.305: IC1.2 90.81,45.72 92.71,43.81 99.69,43.81 100.33,44.45 100.33,50.8 100.97,51.44 R44.2
  Bottom 0.305: R70.2 140.97,47.62 113.03,47.62 111.76,48.9 111.76,50.16 110.49,51.44 U3.13 R44.2
GPB2
  Top 0.305: IC1.3 99.06,48.26 99.69,48.9 99.69,55.88 100.33,56.52 R43.2
  Bottom 0.305: R71.2 140.97,52.7 113.03,52.7 111.76,53.98 111.76,55.24 110.49,56.52 U3.11 R43.2
GPB3
  Top 0.305: IC1.4 90.81,50.8 92.71,48.9 98.42,48.9 99.06,49.53 99.06,60.96 99.69,61.59 R42.2
  Bottom 0.305: R72.2 140.97,57.78 113.03,57.78 111.76,59.05 111.76,60.33 110.49,61.59 U3.9 R42.2
GPB4
  Top 0.305: IC1.5 97.79,53.34 98.42,53.98 98.42,68.58 99.06,69.22 R49.2
  Bottom 0.305: R73.2 140.97,65.41 113.03,65.41 111.76,66.67 111.76,67.94 110.49,69.22 U4.15 R49.2
GPB5
  Top 0.305: IC1.6 90.81,55.88 92.71,53.98 97.16,53.98 97.79,54.61 97.79,73.66 98.42,74.3 R48.2
  Bottom 0.305: R74.2 140.97,70.48 113.03,70.48 111.76,71.75 111.76,73.03 110.49,74.3 U4.13 R48.2
GPB6
  Top 0.305: IC1.7 96.52,58.42 97.16,59.05 97.16,78.74 97.79,79.38 R47.2
  Bottom 0.305: R75.2 140.97,75.56 113.03,75.56 111.76,76.83 111.76,78.11 110.49,79.38 U4.11 R47.2
GPB7
  Top 0.305: IC1.8 81.28,60.96 83.19,59.05 95.89,59.05 96.52,59.69 96.52,83.82 97.16,84.45 R46.2
  Bottom 0.305: R76.2 140.97,80.64 113.03,80.64 111.76,81.92 111.76,83.19 110.49,84.45 U4.9 R46.2
N$1
  Bottom 0.305: R61.1 U5.1
N$3
  Top 0.305: R2.2 LED1.A
N$5
  Top 0.305: R4.2 LED2.A
N$6
  Top 0.305: R6.2 LED3.A
N$7
  Top 0.305: R8.2 LED4.A
N$11
  Bottom 0.305: R62.1 U5.3
N$12
  Bottom 0.305: R63.1 U5.5
N$13
  Bottom 0.305: R64.1 U5.7
N$14
  Bottom 0.305: R65.1 U6.1
N$15
  Bottom 0.305: R66.1 U6.3
N$16
  Top 0.305: R10.2 LED5.A
N$17
  Bottom 0.305: R67.1 U6.5
N$18
  Bottom 0.305: R68.1 U6.7
N$19
  Bottom 0.305: U7.1 R69.1
N$20
  Top 0.305: R12.2 LED6.A
N$22
  Bottom 0.305: U7.3 R70.1
N$23
  Top 0.305: R14.2 LED7.A
N$25
  Bottom 0.305: U7.5 R71.1
N$26
  Top 0.305: R16.2 LED8.A
N$29
  Bottom 0.305: U7.7 R72.1
N$30
  Top 0.305: R18.2 LED9.A
N$31
  Bottom 0.305: U8.1 R73.1
N$32
  Bottom 0.305: U8.3 R74.1
N$33
  Top 0.305: R20.2 LED10.A
N$35
  Bottom 0.305: U8.5 R75.1
N$36
  Top 0.305: R22.2 LED11.A
N$38
  Bottom 0.305: U8.7 R76.1
N$39
  Top 0.305: R24.2 LED12.A
N$41
  Top 0.305: R26.2 LED13.A
N$44
  Top 0.305: R28.2 LED14.A
N$47
  Top 0.305: R30.2 LED15.A
N$50
  Top 0.305: R32.2 LED16.A
N$52
  Top 0.305: LED17.A R33.2
N$59
  Top 0.61: IOX1.1 46.35,91.44 44.45,93.34 34.92,93.34 33.66,92.08 R57.2
N$60
  Top 0.61: R58.2 88.9,92.08 90.17,93.34 99.69,93.34 IOX2.1
N$61
  Top 0.61: R59.2 43.18,91.44 45.72,88.9 49.53,88.9 50.8,90.17 IOX1.3
N$62  (via drill 0.6)
  Top 0.305: 65.41,68.58 IC1.18 75.56,68.58 76.83,69.85 85.72,69.85 87,71.12 87,94.61 88.27,95.89 v97.79,95.89 | 65.41,68.58 62.23,68.58 60.96,69.85 60.96,88.64 60.06,89.53 56.52,89.53 55.88,90.17 IOX1.7 | R50.1 65.41,68.58
  Bottom 0.305: v97.79,95.89 98.42,96.52 106.68,96.52 107.95,95.25 107.95,92.71 IOX2.7
N$66
  Top 0.305: IC1.17 75.56,71.12 76.83,72.39 76.83,77.47 78.11,78.74 80.64,78.74 R51.2 83.19,87 82.55,87.63 R54.2
N$67
  Top 0.305: IC1.16 74.3,73.66 75.56,74.93 75.56,80.01 R52.2 76.83,87 76.2,87.63 R55.2
N$68
  Top 0.305: IC1.15 72.39,79.38 R53.2 70.48,87 69.85,87.63 R56.2
N$71
  Top 0.61: R60.2 97.16,91.44 99.06,89.53 103.5,89.53 104.14,90.17 IOX2.3
R1
  Bottom 0.305: U1.1 U5.15 26.67,83.82 25.4,82.55 1.91,82.55 1.27,81.92 1.27,26.67 R1.2
R3
  Bottom 0.305: U1.3 U5.13 26.67,78.74 25.4,77.47 2.54,77.47 1.91,76.83 1.91,40.01 3.81,38.1 8.26,38.1 10.16,36.2 10.16,26.67 R3.2
R5
  Bottom 0.305: U1.5 U5.11 27.3,73.66 26.04,72.39 3.17,72.39 2.54,71.75 2.54,40.64 4.45,38.73 17.14,38.73 19.68,36.2 19.68,26.04 R5.2
R7
  Bottom 0.305: U1.7 U5.9 27.3,68.58 26.04,67.31 3.81,67.31 3.17,66.67 3.17,41.27 5.08,39.37 24.77,39.37 27.94,36.2 27.94,26.67 R7.2
R9
  Bottom 0.305: U2.1 U6.15 27.94,59.69 4.45,59.69 3.81,59.05 3.81,41.91 5.71,40.01 25.4,40.01 29.21,36.2 35.56,36.2 36.83,34.92 36.83,26.67 R9.2
R11
  Bottom 0.305: U2.3 U6.13 27.94,54.61 5.08,54.61 4.45,53.98 4.45,42.55 6.35,40.64 26.04,40.64 29.84,36.83 43.81,36.83 45.72,34.92 45.72,26.67 R11.2
R13
  Bottom 0.305: U2.5 U6.11 27.94,49.53 5.71,49.53 5.08,48.9 5.08,43.18 6.99,41.27 26.67,41.27 30.48,37.47 52.07,37.47 54.61,34.92 54.61,26.67 R13.2
R15
  Bottom 0.305: U2.7 U6.9 29.21,40.16 31.27,38.1 60.33,38.1 63.5,34.92 63.5,26.67 R15.2
R17
  Bottom 0.305: R17.2 92.08,26.04 92.08,34.92 95.89,38.73 141.6,38.73 143.51,40.64 151.76,40.64 154.31,43.18 154.31,44.45 153.67,45.09 121.92,45.09 U7.15 U3.1
R19
  Bottom 0.305: R19.2 100.97,26.04 100.97,34.92 104.14,38.1 142.24,38.1 144.15,40.01 152.4,40.01 154.94,42.55 154.94,49.53 154.31,50.16 121.92,50.16 U7.13 U3.3
R21
  Bottom 0.305: R21.2 109.86,26.04 109.86,34.92 112.39,37.47 142.88,37.47 144.78,39.37 153.03,39.37 155.57,41.91 155.57,54.61 154.94,55.24 121.92,55.24 U7.11 U3.5
R23
  Bottom 0.305: R23.2 118.75,26.04 118.75,34.92 120.65,36.83 143.51,36.83 145.41,38.73 153.67,38.73 156.21,41.27 156.21,59.69 155.57,60.33 121.92,60.33 U7.9 U3.7
R25
  Bottom 0.305: R25.2 127.64,26.04 127.64,34.92 128.91,36.2 144.15,36.2 146.05,38.1 154.31,38.1 156.84,40.64 156.84,67.31 156.21,67.94 125.73,67.94 124.46,66.67 U8.15 U4.1
R27
  Bottom 0.305: R27.2 136.53,26.04 136.53,34.92 137.16,35.56 144.78,35.56 146.69,37.47 154.94,37.47 157.48,40.01 157.48,72.39 156.84,73.03 125.73,73.03 124.46,71.75 U8.13 U4.3
R29
  Bottom 0.305: R29.2 145.41,26.04 145.41,34.92 147.32,36.83 155.57,36.83 158.12,39.37 158.12,77.47 157.48,78.11 125.73,78.11 124.46,76.83 U8.11 U4.5
R31
  Bottom 0.305: R31.2 158.75,30.48 158.75,82.55 158.12,83.19 125.73,83.19 124.46,81.92 U8.9 U4.7
SCL  (via drill 0.6)
  Top 0.305: IC1.12 84.45,71.12 85.72,72.39 v85.72,94.61 85.72,95.89 87,97.16 104.14,97.16 105.41,95.89 105.41,92.71 IOX2.5
  Bottom 0.305: IOX1.5 54.61,92.71 59.05,92.71 60.96,94.61 v85.72,94.61 | R78.2 70.48,64.77 76.2,64.77 76.83,65.41 76.83,70.48 77.47,71.12 IC1.12
SDA  (via drill 0.6)
  Top 0.305: IC1.13 83.19,73.66 84.45,74.93 84.45,97.16 | 84.45,97.16 85.72,98.42 105.41,98.42 106.68,97.16 IOX2.6 | 84.45,97.16 83.19,95.89 v63.5,95.89
  Bottom 0.305: v63.5,95.89 55.24,95.89 IOX1.6 | IC1.13 76.2,73.66 75.56,73.03 75.56,67.94 74.93,67.31 69.85,67.31 R77.2
VDD
  Top 0.61: 40.01,87 40.01,88.27 R59.1 R57.1 30.48,88.9 28.57,90.81 28.57,97.16 30.48,99.06 34.92,99.06 35.56,98.42 JP1.2 JP1.1 60.96,95.89 65.41,91.44 | 40.01,87 40.01,83.82 | U1.16 40.01,83.82 | 40.01,83.82 40.01,78.74 | U1.14 40.01,78.74 | 40.01,78.74 40.01,73.66 | U1.12 40.01,73.66 | 40.01,73.66 40.01,68.58 | U1.10 40.01,68.58 | 40.01,60.96 40.01,68.58 | U2.16 40.01,60.96 | 40.01,60.96 40.01,55.88 | U2.14 40.01,55.88 | 40.01,55.88 40.01,50.8 | U2.12 40.01,50.8 | 40.01,50.8 40.01,46.62 40.9,45.72 U2.10 | 65.41,91.44 R53.1 R52.1 R51.1 | R50.2 65.41,91.44 | 109.86,81.92 109.86,87 108.58,88.27 94.61,88.27 R60.1 R58.1 C3.+ 90.81,79.38 91.44,78.74 91.44,65.41 89.53,63.5 C1.1 IC1.9 | U4.10 109.86,81.92 | 109.86,81.92 109.86,76.83 | U4.12 109.86,76.83 | 109.86,76.83 109.86,71.75 | U4.14 109.86,71.75 | 109.86,71.75 109.86,66.67 | U4.16 109.86,66.67 | 109.86,66.67 109.86,59.05 | U3.10 109.86,59.05 | 109.86,59.05 109.86,53.98 | U3.12 109.86,53.98 | 109.86,53.98 109.86,48.9 | U3.14 109.86,48.9 | 109.86,48.9 109.86,44.71 108.96,43.81 U3.16 | 40.01,87 56.52,87 58.42,85.09 R77.1 R78.1
  Bottom 0.61: R51.1 84.45,91.44 87,88.9 R58.1
VSS  (via drill 0.9)
  Top 0.61: U6.8 22.86,45.72 23.5,46.35 23.5,50.8 | U6.6 23.5,50.8 | 23.5,50.8 23.5,55.88 | 23.5,55.88 U6.4 | 23.5,60.96 23.5,55.88 | U6.2 23.5,60.96 | 23.5,60.96 23.5,68.58 | 23.5,68.58 U5.8 | U5.6 23.5,73.66 | 23.5,73.66 23.5,68.58 | U5.4 23.5,78.74 | 23.5,78.74 23.5,73.66 | U5.2 23.5,83.82 | 23.5,83.82 23.5,78.74 | 126.36,81.92 126.36,76.83 | U8.6 126.36,76.83 | 126.36,76.83 126.36,71.75 | U8.4 126.36,71.75 | 126.36,71.75 126.36,66.67 | U8.2 126.36,66.67 | 126.36,66.67 126.36,59.05 | U7.8 126.36,59.05 | 126.36,59.05 126.36,53.98 | U7.6 126.36,53.98 | 126.36,53.98 126.36,48.9 | U7.4 126.36,48.9 | 126.36,48.9 126.36,44.71 127.26,43.81 U7.2 | U8.8 126.36,81.92 | 23.5,83.82 v23.5,94.61 | 126.36,81.92 v126.36,94.61
  Bottom 0.61: v126.36,94.61 120.02,94.61 | v23.5,94.61 28.57,94.61 28.57,95.89 JP1.4 | IC1.10 85.09,66.04 C1.2
  pour Bottom (isolate 0.61): 28.57,99.69 28.57,88.27 32.38,88.27 32.38,87 47.62,87 47.62,40.64 102.23,40.64 102.23,87 121.28,87 121.28,99.69
X1-3
  Top 0.305: R1.1 R2.1 10.16,31.75 10.16,13.97 13.34,10.79 62.87,10.79 63.5,10.16 63.5,8.26 64.14,7.62 66.04,7.62 X1.3
X1-4
  Top 0.305: R3.1 R4.1 17.14,34.29 19.68,31.75 19.68,14.61 22.86,11.43 64.77,11.43 X1.4
X1-5
  Top 0.305: R5.1 R6.1 27.94,31.75 27.94,15.24 31.11,12.06 66.04,12.06 68.58,9.53 68.58,7.62 X1.5
X1-6
  Top 0.305: R7.1 R8.1 34.29,33.02 33.02,31.75 33.02,15.88 36.2,12.7 67.31,12.7 69.85,10.16 X1.6
X1-7
  Top 0.305: R9.1 R10.1 45.72,31.75 45.72,16.51 48.9,13.34 67.94,13.34 71.12,10.16 71.12,7.62 X1.7
X1-8
  Top 0.305: R11.1 R12.1 54.61,31.75 54.61,17.14 57.78,13.97 68.58,13.97 72.39,10.16 X1.8
X1-9
  Top 0.305: R13.1 R14.1 63.5,31.75 63.5,17.78 66.67,14.61 69.22,14.61 73.66,10.16 73.66,7.62 X1.9
X1-10
  Top 0.305: R15.1 R16.1 72.39,31.75 72.39,12.7 74.93,10.16 X1.10
X1-11
  Top 0.305: R18.1 R17.1 87.63,31.75 87.63,18.41 84.45,15.24 81.28,15.24 76.2,10.16 76.2,7.62 X1.11
X1-12
  Top 0.305: R20.1 R19.1 96.52,31.75 96.52,17.78 93.34,14.61 81.92,14.61 77.47,10.16 X1.12
X1-13
  Top 0.305: R22.1 R21.1 105.41,31.75 105.41,17.14 102.23,13.97 82.55,13.97 78.74,10.16 78.74,7.62 X1.13
X1-14
  Top 0.305: R24.1 R23.1 119.38,31.75 119.38,17.14 115.57,13.34 83.19,13.34 80.01,10.16 X1.14
X1-15
  Top 0.305: R26.1 R25.1 123.19,31.75 123.19,15.88 120.02,12.7 83.82,12.7 81.28,10.16 81.28,7.62 X1.15
X1-16
  Top 0.305: R28.1 R27.1 132.08,31.75 132.08,15.24 128.91,12.06 84.45,12.06 82.55,10.16 X1.16
X1-17
  Top 0.305: R30.1 R29.1 140.97,31.75 140.97,14.61 137.79,11.43 85.09,11.43 83.82,10.16 83.82,7.62 X1.17
X1-18
  Top 0.305: R32.1 R31.1 149.86,31.75 149.86,13.34 147.32,10.79 85.72,10.79 85.09,10.16 X1.18

### Text on the board
Top: 01-2012 | Design by JSIF | OPTO_BOARD_4_IOX
tNames: EXT.SUPPLY | 2 | 2 | 0V | 3.3/5V | 1 | 1 | 01-2012 | Design by JSIF | INPUT | OUTPUT | OUTPUT | INPUT | INPUT | OUTPUT | OUTPUT | INPUT | OPTO_BOARD_4_IOX | 2 | 26 | 12V | 1 | 25